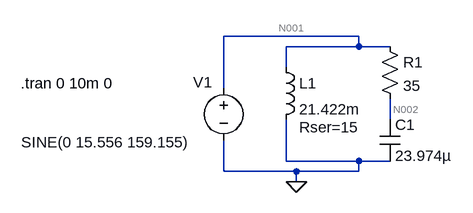
[diagram p0: schematic 1_9.asc]
1_9.asc, the LTspice schematic file:
Version 4.1
SHEET 1 880 680
WIRE 384 0 176 0
WIRE 384 16 384 0
WIRE 384 16 272 16
WIRE 432 16 384 16
WIRE 272 48 272 16
WIRE 176 80 176 0
WIRE 432 128 432 96
WIRE 272 192 272 128
WIRE 384 192 272 192
WIRE 432 192 384 192
WIRE 176 208 176 160
WIRE 288 208 176 208
WIRE 384 208 384 192
WIRE 384 208 288 208
WIRE 288 224 288 208
FLAG 288 224 0
SYMBOL voltage 176 64 R0
WINDOW 123 0 0 Left 0
WINDOW 39 24 124 Left 2
WINDOW 0 -47 7 Left 2
WINDOW 3 -311 99 Left 2
SYMATTR InstName V1
SYMATTR Value SINE(0 15.556 159.155)
SYMBOL res 416 0 R0
SYMATTR InstName R1
SYMATTR Value 35
SYMBOL cap 416 128 R0
SYMATTR InstName C1
SYMATTR Value 23.974µ
SYMBOL ind 256 32 R0
WINDOW 39 36 108 Left 2
SYMATTR SpiceLine Rser=15
SYMATTR InstName L1
SYMATTR Value 21.422m
TEXT -136 72 Left 2 !.tran 0 10m 0

The netlist it stands for:
* 1_9.asc
V1 N001 0 SINE(0 15.556 159.155)
R1 N001 N002 35
C1 N002 0 23.974µ
L1 N001 0 21.422m Rser=15
.tran 0 10m 0
.backanno
.end

* Results of the author's LTspice run, read from the files saved beside the schematic
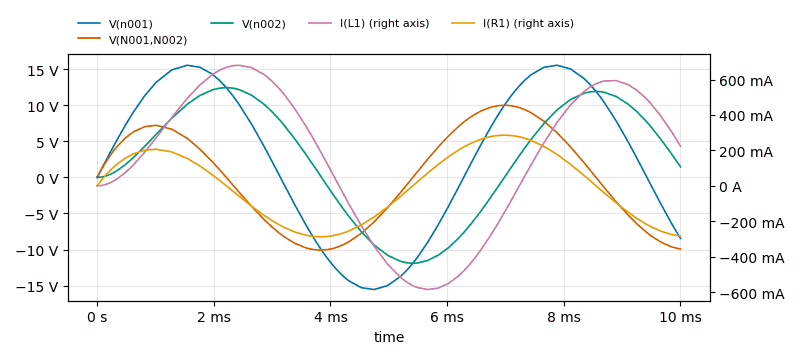
[diagram p1: Transient Analysis of 1_9.asc, plotted from the saved traces]
* Transient Analysis, 1 run:
*   V(n001): min -15.55 V, max 15.55 V, average 2.85 V, rms 10.73 V, last -8.463 V
*   V(N001,N002): min -10.08 V, max 9.997 V, average 117.4 mV, rms 6.67 V, last -9.924 V
*   V(n002): min -11.9 V, max 12.45 V, average 2.733 V, rms 8.41 V, last 1.461 V
*   I(L1): min -585.6 mA, max 680.7 mA, average 158.6 mA, rms 437.8 mA, last 223.7 mA
*   I(R1): min -287.9 mA, max 285.6 mA, average 3.354 mA, rms 190.6 mA, last -283.5 mA